# Altium schematic sheet Robot-Control.schdoc
size 449 x 193 mm
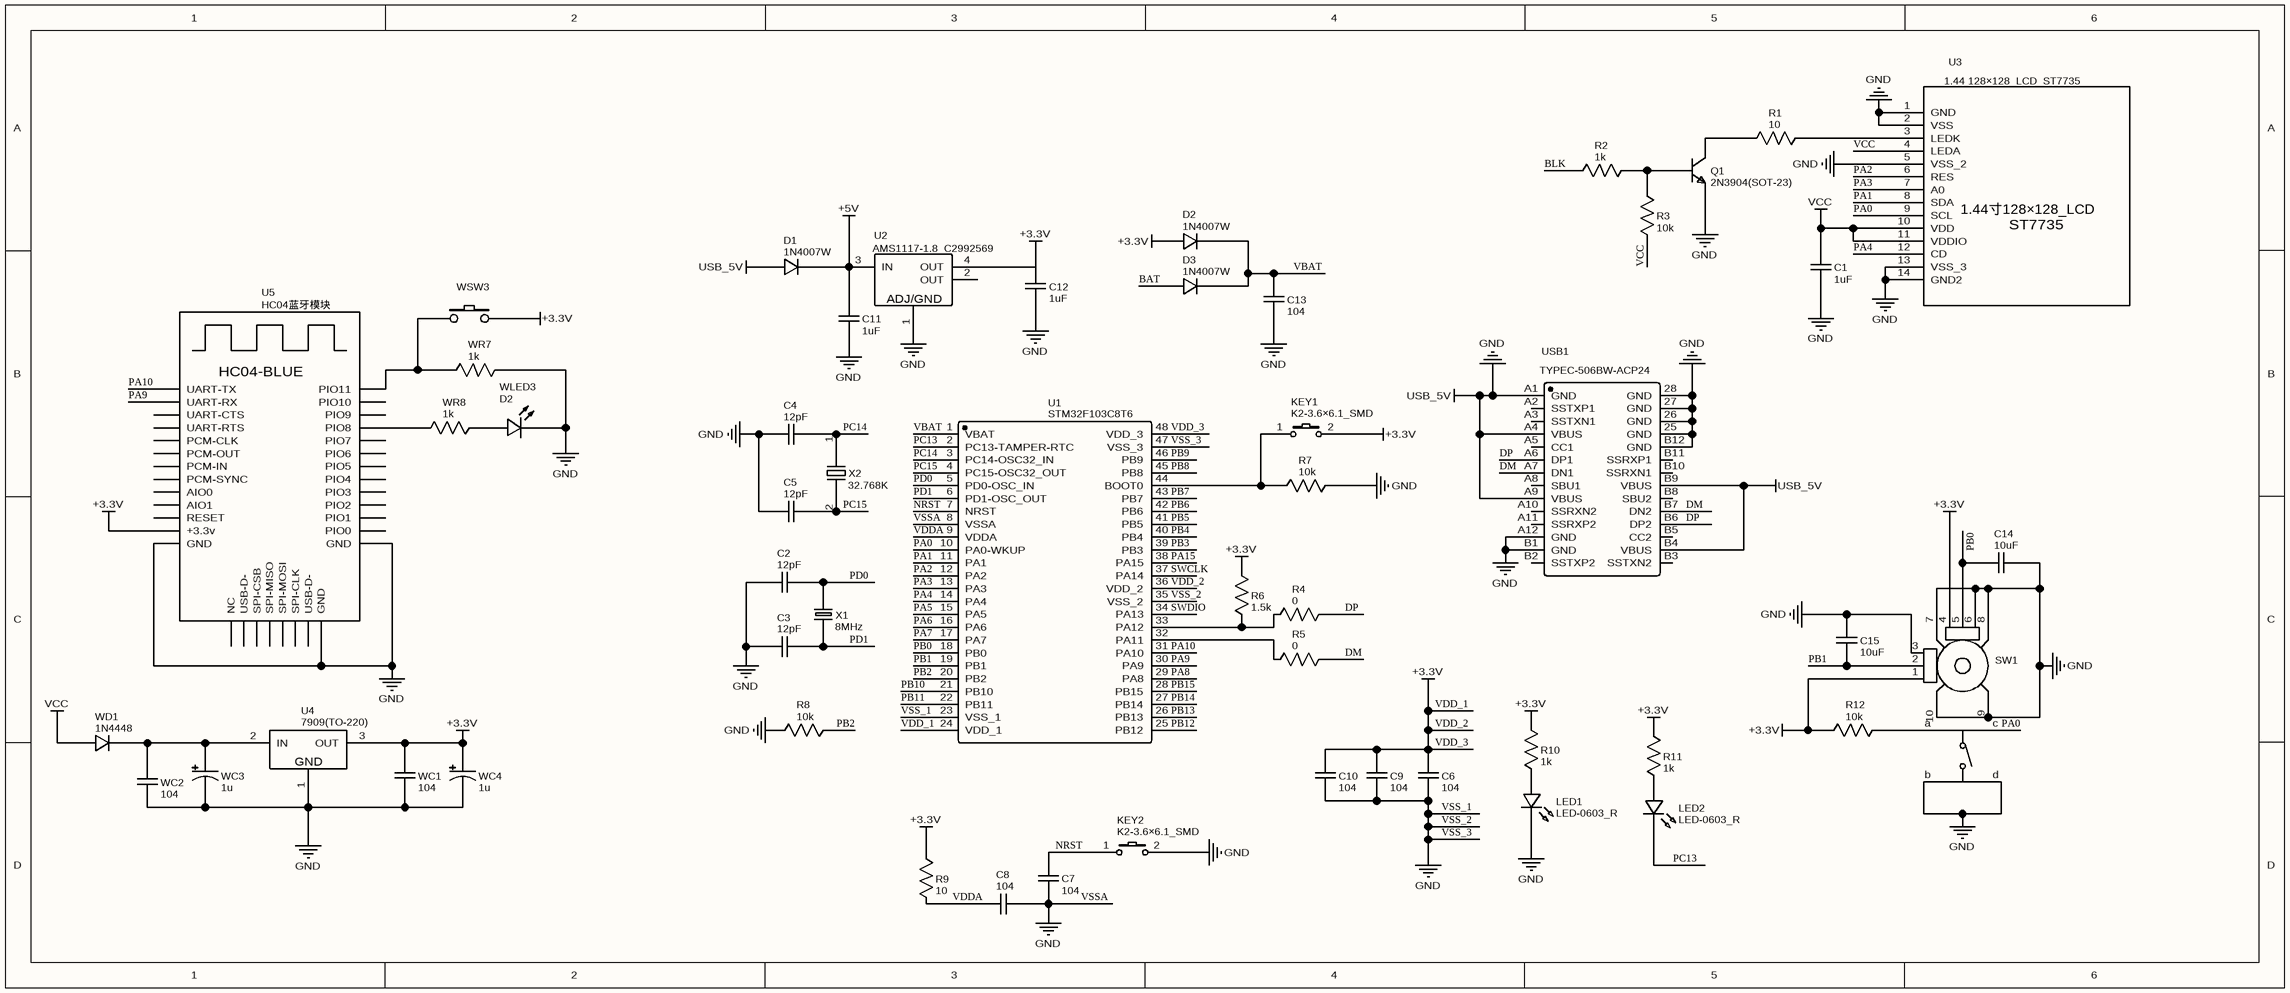
[diagram p0: Robot-Control.schdoc]

## Parts
C1  1uF  [C0603]
C2  12pF  [C0603]
C3  12pF  [C0603]
C4  12pF  [C0603]
C5  12pF  [C0603]
C6  104  [C0603]
C7  104  [C0603]
C8  104  [C0603]
C9  104  [C0603]
C10  104  [C0603]
C11  1uF  [C0603]
C12  1uF  [C0603]
C13  104  [C0603]
C14  10uF  [C0603]
C15  10uF  [C0603]
D1  1N4007W  [SOD-123_L2.8-W1.8-LS3.7-RD]
D2  1N4007W  [SOD-123_L2.8-W1.8-LS3.7-RD]
D3  1N4007W  [SOD-123_L2.8-W1.8-LS3.7-RD]
KEY1  K2-3.6×6.1_SMD  [KEY-SMD_2P-L6.2-W3.6-LS8.0]
KEY2  K2-3.6×6.1_SMD  [KEY-SMD_2P-L6.2-W3.6-LS8.0]
LED1  LED-0603_R  [LED0603_RED]
LED2  LED-0603_R  [LED0603_RED]
Q1  2N3904(SOT-23)  [SOT-23-3_L2.9-W1.3-P1.90-LS2.4-TR]
R1  10  [R0603]
R2  1k  [R0603]
R3  10k  [R0603]
R4  0  [R0603]
R5  0  [R0603]
R6  1.5k  [R0603]
R7  10k  [R0603]
R8  10k  [R0603]
R9  10  [R0603]
R10  1k  [R0603]
R11  1k  [R0603]
R12  10k  [R0603]
SW1  RKJXV1224005  [SW-TH_RKJXV1224005]  (value not drawn)
U1  STM32F103C8T6  [LQFP-48_L7.0-W7.0-P0.50-LS9.0-BL]
U2  AMS1117-1.8_C2992569  [SOT-223-3_L6.4-W3.5-P2.30-LS7.0-BR]
U3  1.44 128×128_LCD_ST7735  [1.44 128×128_LCD_ST7735【华迪短】]
U4  7909(TO-220)  [TO-220IS_L10.16-W4.7-P2.54-L]
U5  HC04蓝牙模块
USB1  TYPEC-506BW-ACP24  [USB-C-SMD_TYPEC-506BW-ACP24]
WC1  104  [RAD-0.1]
WC2  104  [RAD-0.1]
WC3  1u  [CAP-D3.0XF1.5]
WC4  1u  [CAP-D3.0XF1.5]
WD1  1N4448  [DO-35]
WLED3  D2  [LED-3MM/2.54]
WR7  1k  [AXIAL-0.3]
WR8  1k  [AXIAL-0.3]
WSW3  EVQ22705R  [KEY-6.0*6.0-4]  (value not drawn)
X1  8MHz  [HC-49S_L11.4-W4.8]
X2  32.768K  [OSC-SMD_2P-L3.2-W1.5-1]

## Nets
+5V: C11.1 D1.1 U2.3(IN)
VCC: C1.2 R3.1 U3.4(LEDA) U3.10(VDD) U3.11(VDDIO) WD1.1(A)
VDD_1: C1.1 C2.1 C3.1 C4.1 C5.1 C6.1 C6.2 C7.1 C8.1 C9.1 C9.2 C10.1 C10.2 C11.2 C12.1 C12.2 C13.2 C14.2 C15.2 D1.2 D2.2 KEY1.2 KEY2.2 LED1.2 Q1.1(E) R6.2 R7.2 R8.1 R9.1 R10.1 R11.1 R12.1 SW1.1(B) SW1.3(A) SW1.4(A) SW1.6(B) SW1.7(GND) SW1.8(GND) SW1.9(GND) SW1.10(GND) SW1.b SW1.d U1.8(VSSA) U1.23(VSS_1) U1.24(VDD_1) U1.35(VSS_2) U1.36(VDD_2) U1.47(VSS_3) U1.48(VDD_3) U2.1(ADJ/GND) U3.1(GND) U3.2(VSS) U3.5(VSS_2) U3.13(VSS_3) U3.14(GND2) U4.1(GND) U4.3(OUT) U5.14(GND) U5.15(+3.3v) U5.28(GND) U5.36(GND) USB1.25(GND) USB1.26(GND) USB1.27(GND) USB1.28(GND) USB1.A1(GND) USB1.A4(VBUS) USB1.A9(VBUS) USB1.A12(GND) USB1.B1(GND) USB1.B4(VBUS) USB1.B9(VBUS) USB1.B12(GND) WC1.1 WC1.2 WC2.1 WC3.2 WC4.1 WC4.2 WLED3.2(K) WR7.2 WSW3.2  [also labelled +3.3V, GND, USB_5V, VDD_2, VDD_3, VSS_1, VSS_2, VSS_3, VSSA]
BAT: D3.2
BLK: R2.1
DM: R5.2 USB1.A7(DN1) USB1.B7(DN2)
DP: R4.2 USB1.A6(DP1) USB1.B6(DP2)
NRST: C7.2 KEY2.1 U1.7(NRST)
PA0: SW1.c U1.10(PA0-WKUP) U3.9(SCL)
PA1: U1.11(PA1) U3.8(SDA)
PA2: U1.12(PA2) U3.6(RES)
PA3: U1.13(PA3) U3.7(A0)
PA4: U1.14(PA4) U3.12(CD)
PA5: U1.15(PA5)
PA6: U1.16(PA6)
PA7: U1.17(PA7)
PA8: U1.29(PA8)
PA9: U1.30(PA9) U5.26(UART-RX)
PA10: U1.31(PA10) U5.27(UART-TX)
PA15: U1.38(PA15)
PB0: C14.1 SW1.5(DTA) U1.18(PB0)
PB1: C15.1 SW1.2(DTA) U1.19(PB1)
PB2: R8.2 U1.20(PB2)
PB3: U1.39(PB3)
PB4: U1.40(PB4)
PB5: U1.41(PB5)
PB6: U1.42(PB6)
PB7: U1.43(PB7)
PB8: U1.45(PB8)
PB9: U1.46(PB9)
PB10: U1.21(PB10)
PB11: U1.22(PB11)
PB12: U1.25(PB12)
PB13: U1.26(PB13)
PB14: U1.27(PB14)
PB15: U1.28(PB15)
PC13: LED2.2 U1.2(PC13-TAMPER-RTC)
PC14: C4.2 U1.3(PC14-OSC32_IN) X2.1
PC15: C5.2 U1.4(PC15-OSC32_OUT) X2.2
PD0: C2.2 U1.5(PD0-OSC_IN) X1.2
PD1: C3.2 U1.6(PD1-OSC_OUT) X1.1
SWCLK: U1.37(PA14)
SWDIO: U1.34(PA13)
VBAT: C13.1 D2.1 D3.1 U1.1(VBAT)
VDDA: C8.2 R9.2 U1.9(VDDA)
NetKEY1_1: KEY1.1 R7.1 U1.44(BOOT0)
NetLED1_1: LED1.1 R10.2
NetLED2_1: LED2.1 R11.2
NetQ1_2: Q1.2(B) R2.2 R3.2
NetQ1_3: Q1.3(C) R1.1
NetR1_2: R1.2 U3.3(LEDK)
NetR4_1: R4.1 R6.1 U1.33(PA12)
NetR5_1: R5.1 U1.32(PA11)
NetR12_2: R12.2 SW1.a
NetU4_2: U4.2(IN) WC2.2 WC3.1 WD1.2(K)
NetU5_10: U5.10(PIO8) WR8.1
NetU5_13: U5.13(PIO11) WR7.1 WSW3.1
NetWLED3_1: WLED3.1(A) WR8.2

Not connected (* = marked no-connect by the designer): U2 2(OUT) 4(OUT); U5 2(PIO0) 3(PIO1) 4(PIO2) 5(PIO3) 6(PIO4) 7(PIO5) 8(PIO6) 9(PIO7) 11(PIO9) 12(PIO10) 16(RESET) 17(AIO0) 18(AIO1) 19(PCM-SYNC) 20(PCM-IN) 21(PCM-OUT) 22(PCM-CLK) 24(UART-RTS) 25(UART-CTS) 29(USB-D-) 30(SPI-CLK) 31(SPI-MOSI) 32(SPI-MISO) 33(SPI-CSB) 34(USB-D-) 35(NC); USB1 A2(SSTXP1) A3(SSTXN1) A5(CC1) A8(SBU1) A10(SSRXN2) A11(SSRXP2) B2(SSTXP2) B3(SSTXN2) B5(CC2) B8(SBU2) B10(SSRXN1) B11(SSRXP1)

## Notes on the sheet
- (in symbol 1.44 128×128_LCD_ST7735) 1.44寸128×128_LCD / ST7735
- (in symbol HC04蓝牙模块) HC04-BLUE

## Library data of the parts
C1 C11 C12 = 1uF: nameAlias: Value(F); Contributor: LCEDA_Lib; spicePre: C; spiceSymbolName: C_0603_US
C2-C5 = 12pF: nameAlias: Value(F); Contributor: LCEDA_Lib; spicePre: C; spiceSymbolName: C_0603_US
C6-C10 C13 = 104: nameAlias: Value(F); Contributor: LCEDA_Lib; spicePre: C; spiceSymbolName: C_0603_US
C14 C15 = 10uF: nameAlias: Value(F); Contributor: LCEDA_Lib; spicePre: C; spiceSymbolName: C_0603_US
D1-D3 = 1N4007W: Manufacturer: BLUE ROCKET; Contributor: LCEDA_Lib; Supplier: LCSC; Supplier Part: C328592; Manufacturer Part: 1N4007W; spicePre: D; spiceSymbolName: 1N4007W
KEY1 KEY2 = K2-3.6×6.1_SMD: Manufacturer Part: K2-1107ST-A4SW-06; Contributor: LCEDA_Lib; 制造商: 韩国韩荣; Supplier Part: C118141; Supplier: LCSC; spicePre: K; spiceSymbolName: K2-3.6×6.1_SMD
LED1 LED2 = LED-0603_R: Manufacturer: EVERLIGHT(台湾亿光); Manufacturer Part: 19-217/R6C-AL1M2VY/3T; Contributor: LCEDA_01; Supplier Part: C72044; Supplier: LCSC; spicePre: L; spiceSymbolName: LED-0603_R
Q1 = 2N3904(SOT-23): Manufacturer: KEC; Manufacturer Part: 2n3904S-RTK/PS; Contributor: LCEDA_Lib; Supplier: LCSC; Supplier Part: C18536; Paste Type: SOT-23; spicePre: Q; spiceSymbolName: 2N3904(SOT-23)
R1 R9 = 10: nameAlias: Value(Ω); Contributor: LCEDA_Lib; spicePre: R; spiceSymbolName: R_0603_US
R2 R10 R11 = 1k: nameAlias: Value(Ω); Contributor: LCEDA_Lib; spicePre: R; spiceSymbolName: R_0603_US
R3 R7 R8 R12 = 10k: nameAlias: Value(Ω); Contributor: LCEDA_Lib; spicePre: R; spiceSymbolName: R_0603_US
R4 R5 = 0: nameAlias: Value(Ω); Contributor: LCEDA_Lib; spicePre: R; spiceSymbolName: R_0603_US
R6 = 1.5k: nameAlias: Value(Ω); Contributor: LCEDA_Lib; spicePre: R; spiceSymbolName: R_0603_US
SW1 = RKJXV1224005: Manufacturer: ALPSALPINE(阿尔卑斯阿尔派); Contributor: LCSC; Supplier: LCSC; Supplier Part: C146170; Manufacturer Part: RKJXV1224005; JLCPCB Part Class: Extended Part; spicePre: S; spiceSymbolName: RKJXV1224005
U1 = STM32F103C8T6: Manufacturer: ST(意法半导体); timeStamp: 1455028086; Supplier: LCSC; Manufacturer Part: STM32F103C8T6; Supplier Part: C8734; JLCPCB Part Class: Extended Part; spicePre: U; spiceSymbolName: STM32F103C8T6
U2 = AMS1117-1.8_C2992569: Manufacturer: 国芯佳品; Contributor: lcsc; Supplier: LCSC; Supplier Part: C2992569; Manufacturer Part: AMS1117-1.8; JLCPCB Part Class: Extended Part; spicePre: U; spiceSymbolName: AMS1117-1.8_C2992569
U3 = 1.44 128×128_LCD_ST7735: Contributor: Mutiankai; spicePre: U; spiceSymbolName: 1.44 128×128_LCD_ST7735【华迪短】
U4 = 7909(TO-220): Manufacturer: KEC Semicon; Manufacturer Part: KIA7909PI-U/PF; Contributor: LCEDA_Lib; Supplier: LCSC; Supplier Part: C220503; spicePre: U; spiceSymbolName: 7909(TO-220)
U5 = HC04蓝牙模块: Contributor: wls20010228; spicePre: U; spiceSymbolName: HC04蓝牙模块
USB1 = TYPEC-506BW-ACP24: Manufacturer: XUNPU(讯普); Contributor: LCSC; Supplier: LCSC; Supplier Part: C2895019; Manufacturer Part: TYPEC-506BW-ACP24; JLCPCB Part Class: Extended Part; spicePre: U; spiceSymbolName: TYPEC-506BW-ACP24
WC1 WC2 = 104: nameAlias: Value(F); spicePre: C; spiceSymbolName: Cap_RAD-0.1_US
WC3 WC4 = 1u: nameAlias: Value(F); spicePre: C; spiceSymbolName: Cap_Electrolytic(TH)_D3.0XF1.5_US
WD1 = 1N4448: Manufacturer: SEMTECH; Supplier: LCSC; Manufacturer Part: 1N4448; image: //image.lceda.cn/szlcsc/C54037.jpg; Supplier Part: C54037; spicePre: D; spiceSymbolName: 1N4448
WLED3 = D2: Manufacturer: EVERLIGHT; Manufacturer Part: 204-10SURD/S530-A3; Supplier: LCSC; Supplier Part: C99772; spicePre: L; spiceSymbolName: 204-10SURD/S530-A3
WR7 WR8 = 1k: nameAlias: Value(Ω); spicePre: R; spiceSymbolName: Res_AXIAL-0.3(1/8W)_US
WSW3 = EVQ22705R: Manufacturer: PANASONIC; Contributor: LCSC; Supplier: LCSC; Manufacturer Part: EVQ22705R; Supplier Part: C79156; spicePre: S
X1 = 8MHz: Manufacturer: TAITIEN(泰艺电子); Manufacturer Part: XJHCELNANF-8M; nameAlias: Value; Contributor: LCSC; Supplier: LCSC; Supplier Part: C123298; JLCPCB Part Class: Extended Part; spicePre: X; spiceSymbolName: XJHCCLNAND-8M
X2 = 32.768K: Manufacturer Part: 贴片晶振32.768k; Manufacturer: null; Contributor: LCSC; Supplier: LCSC; Supplier Part: C9900003950; JLCPCB Part Class: Extended Part; spicePre: X; spiceSymbolName: 贴片晶振32.768K